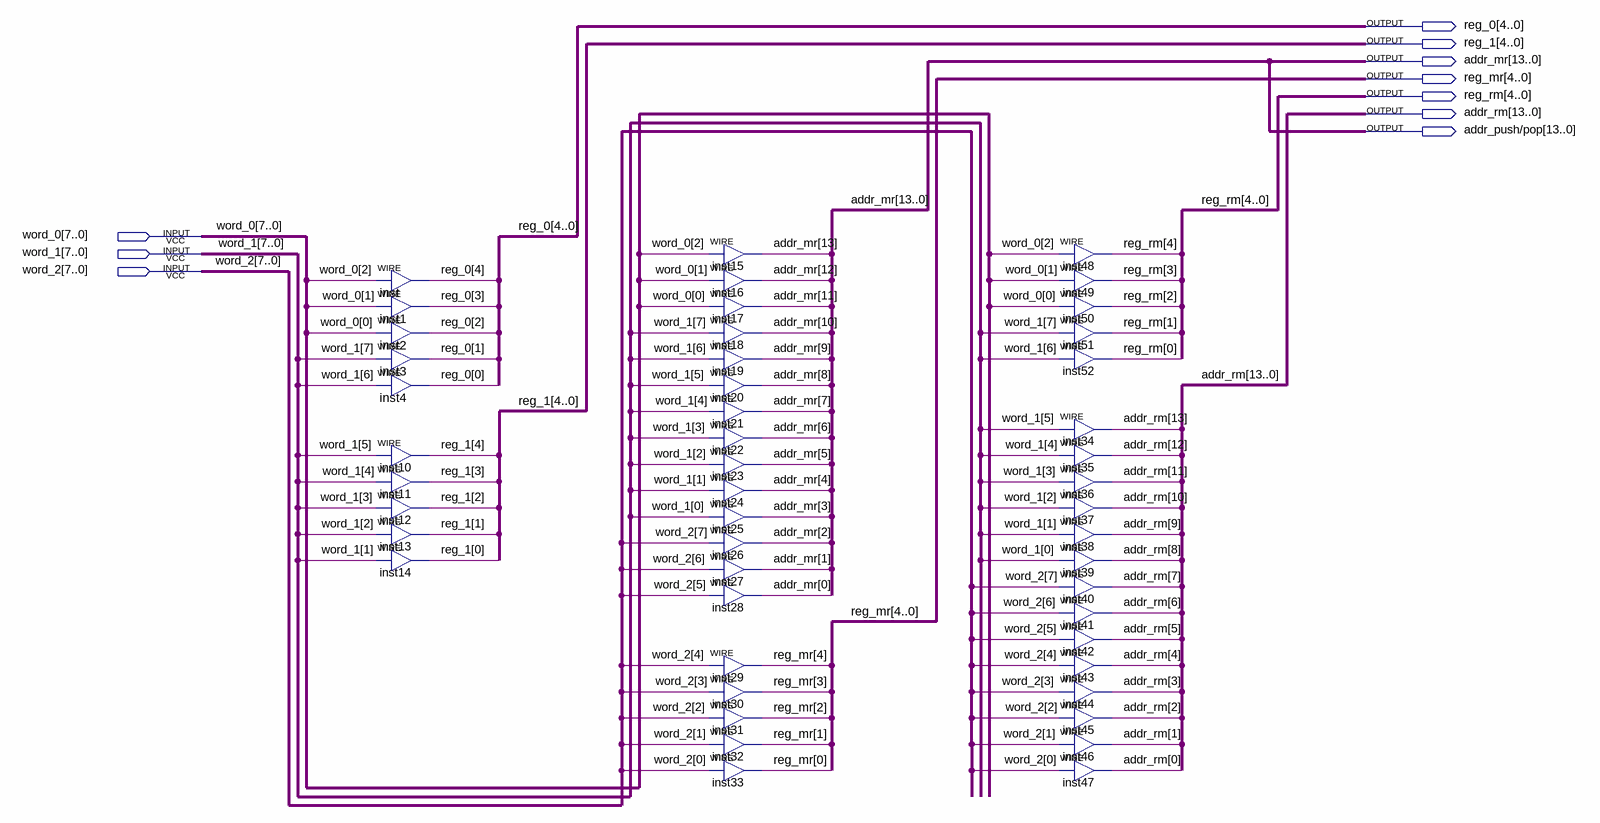
[diagram p0: schematic sheet]
// Quartus schematic parse_input_words.bdf as structural Verilog: 48 symbols, 10 pins
module parse_input_words (
  input  [7:0] word_0,
  input  [7:0] word_1,
  input  [7:0] word_2,
  output [4:0] reg_0,
  output [4:0] reg_1,
  output [13:0] addr_mr,
  output [4:0] reg_mr,
  output [4:0] reg_rm,
  output [13:0] addr_rm,
  output [13:0] \addr_push/pop 
);

  assign reg_0[4] = word_0[2];  // WIRE inst
  assign reg_0[3] = word_0[1];  // WIRE inst1
  assign reg_0[2] = word_0[0];  // WIRE inst2
  assign reg_0[1] = word_1[7];  // WIRE inst3
  assign reg_0[0] = word_1[6];  // WIRE inst4
  assign reg_1[4] = word_1[5];  // WIRE inst10
  assign reg_1[3] = word_1[4];  // WIRE inst11
  assign reg_1[2] = word_1[3];  // WIRE inst12
  assign reg_1[1] = word_1[2];  // WIRE inst13
  assign reg_1[0] = word_1[1];  // WIRE inst14
  assign addr_mr[13] = word_0[2];  // WIRE inst15
  assign addr_mr[12] = word_0[1];  // WIRE inst16
  assign addr_mr[11] = word_0[0];  // WIRE inst17
  assign addr_mr[10] = word_1[7];  // WIRE inst18
  assign addr_mr[9] = word_1[6];  // WIRE inst19
  assign addr_mr[8] = word_1[5];  // WIRE inst20
  assign addr_mr[7] = word_1[4];  // WIRE inst21
  assign addr_mr[6] = word_1[3];  // WIRE inst22
  assign addr_mr[5] = word_1[2];  // WIRE inst23
  assign addr_mr[4] = word_1[1];  // WIRE inst24
  assign addr_mr[3] = word_1[0];  // WIRE inst25
  assign addr_mr[2] = word_2[7];  // WIRE inst26
  assign addr_mr[1] = word_2[6];  // WIRE inst27
  assign addr_mr[0] = word_2[5];  // WIRE inst28
  assign reg_mr[4] = word_2[4];  // WIRE inst29
  assign reg_mr[3] = word_2[3];  // WIRE inst30
  assign reg_mr[2] = word_2[2];  // WIRE inst31
  assign reg_mr[1] = word_2[1];  // WIRE inst32
  assign reg_mr[0] = word_2[0];  // WIRE inst33
  assign reg_rm[4] = word_0[2];  // WIRE inst48
  assign reg_rm[3] = word_0[1];  // WIRE inst49
  assign reg_rm[2] = word_0[0];  // WIRE inst50
  assign reg_rm[1] = word_1[7];  // WIRE inst51
  assign reg_rm[0] = word_1[6];  // WIRE inst52
  assign addr_rm[13] = word_1[5];  // WIRE inst34
  assign addr_rm[12] = word_1[4];  // WIRE inst35
  assign addr_rm[11] = word_1[3];  // WIRE inst36
  assign addr_rm[10] = word_1[2];  // WIRE inst37
  assign addr_rm[9] = word_1[1];  // WIRE inst38
  assign addr_rm[8] = word_1[0];  // WIRE inst39
  assign addr_rm[7] = word_2[7];  // WIRE inst40
  assign addr_rm[6] = word_2[6];  // WIRE inst41
  assign addr_rm[5] = word_2[5];  // WIRE inst42
  assign addr_rm[4] = word_2[4];  // WIRE inst43
  assign addr_rm[3] = word_2[3];  // WIRE inst44
  assign addr_rm[2] = word_2[2];  // WIRE inst45
  assign addr_rm[1] = word_2[1];  // WIRE inst46
  assign addr_rm[0] = word_2[0];  // WIRE inst47

  assign \addr_push/pop  = addr_mr;
endmodule
